# Altium schematic sheet Hélice31-V.2_2026-04-02.schdoc
size 235 x 182 mm
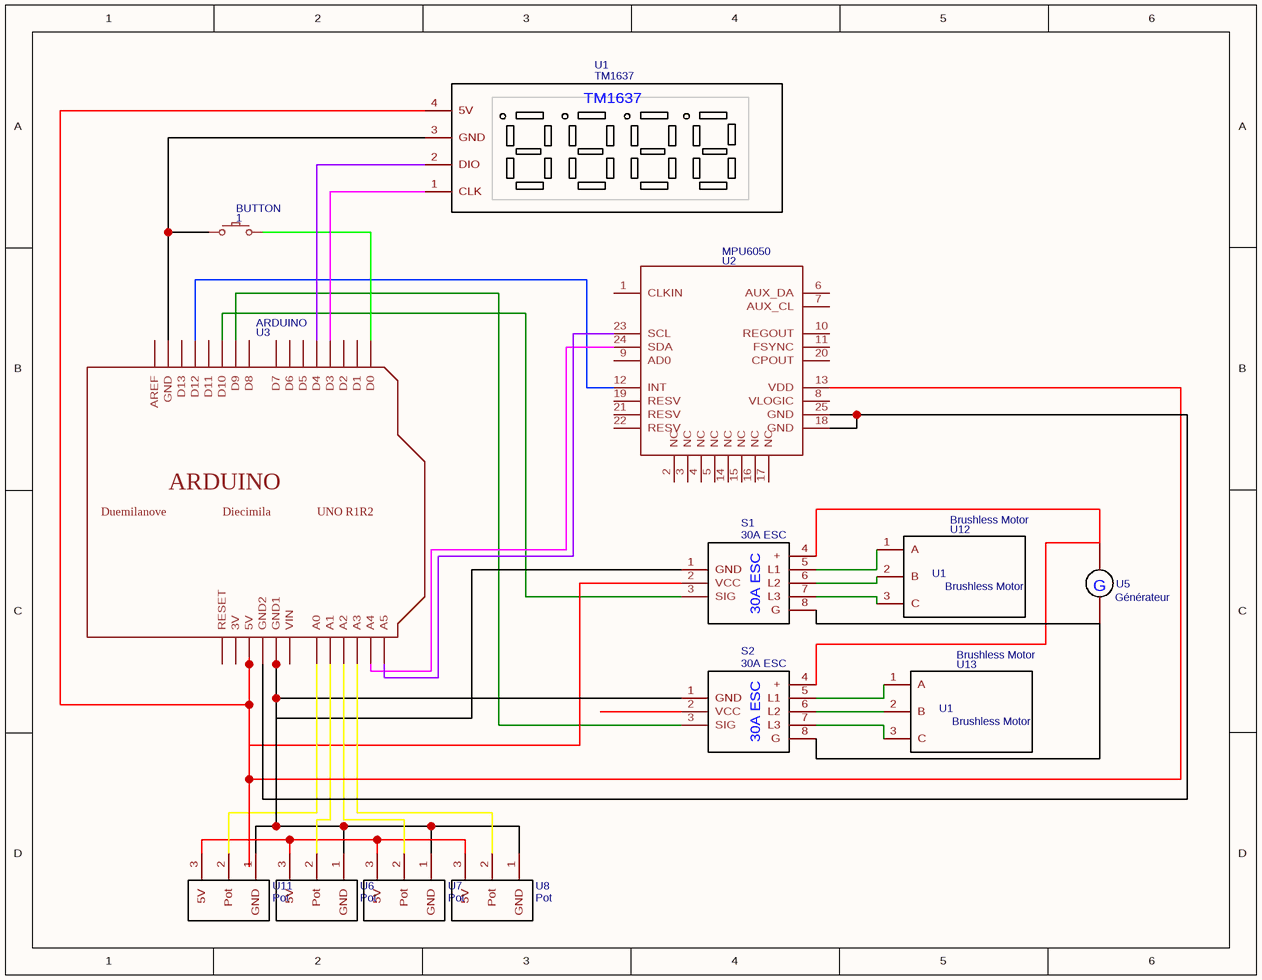
[diagram p0: Hélice31-V.2_2026-04-02.schdoc]

## Parts
1  BUTTON  [32TEETH---CONDUCTIVE-BUTTONS_CONDUCTIVE_BUTTON_DIRECTIONAL_THICK]
S1  30A ESC  [SG90 SERVO]
S2  30A ESC  [SG90 SERVO]
U1  TM1637  [4DIGITS-TM1637]
U2  MPU6050  [QFN50P400X400X95-25T265X275N]
U3  ARDUINO  [ARDUINO]
U5  Générateur
U6  Pot  [POTENTIOMETRE]
U7  Pot  [POTENTIOMETRE]
U8  Pot  [POTENTIOMETRE]
U11  Pot  [POTENTIOMETRE]
U12  Brushless Motor  [BRUSHLESS MOTOR]
U13  Brushless Motor  [BRUSHLESS MOTOR]

## Nets
Net1_P$ACTIVE: 1.P$ACTIVE U3.D0
Net1_P$GND: 1.P$GND U1.3(GND) U3.GND
NetS1_1: S1.1(GND) S2.1(GND) U3.GND1 U6.1(GND) U7.1(GND) U8.1(GND) U11.1(GND)
NetS1_2: S1.2(VCC) U1.4(5V) U2.13(VDD) U3.5V
NetS1_3: S1.3(SIG) U3.D10
NetS1_4: S1.4(+) S2.4(+)
NetS1_5: S1.5(L1) U12.1(A)
NetS1_6: S1.6(L2) U12.2(B)
NetS1_7: S1.7(L3) U12.3(C)
NetS1_8: S1.8(G) S2.8(G)
NetS2_3: S2.3(SIG) U3.D9
NetS2_5: S2.5(L1) U13.1(A)
NetS2_6: S2.6(L2) U13.2(B)
NetS2_7: S2.7(L3) U13.3(C)
NetU1_1: U1.1(CLK) U3.D3
NetU1_2: U1.2(DIO) U3.D4
NetU2_12: U2.12(INT) U3.D12
NetU2_18: U2.18(GND) U2.25(GND) U3.GND2
NetU2_23: U2.23(SCL) U3.A5
NetU2_24: U2.24(SDA) U3.A4
NetU3_A0: U3.A0 U11.2(Pot)
NetU3_A1: U3.A1 U6.2(Pot)
NetU3_A2: U3.A2 U7.2(Pot)
NetU3_A3: U3.A3 U8.2(Pot)
NetU6_3: U6.3(5V) U7.3(5V) U8.3(5V) U11.3(5V)

Not connected (* = marked no-connect by the designer): S2 2(VCC); U2 1(CLKIN) 2(NC) 3(NC) 4(NC) 5(NC) 6(AUX_DA) 7(AUX_CL) 8(VLOGIC) 9(AD0) 10(REGOUT) 11(FSYNC) 14(NC) 15(NC) 16(NC) 17(NC) 19(RESV) 20(CPOUT) 21(RESV) 22(RESV); U3 3V AREF D1 D2 D5 D6 D7 D8 D11 D13 RESET VIN; U5 1 2

## Notes on the sheet
- (in symbol ARDUINO) Duemilanove; Diecimila; UNO R1R2
- (in symbol Brushless Motor) U1
- (in symbol Générateur) G

## Library data of the parts
1 = BUTTON: Contributor: LorenzoVonMatterhorn; spicePre: ?; spiceSymbolName: BUTTON
S1 S2 = 30A ESC: Contributor: ilos; spicePre: S; spiceSymbolName: 30A ESC
U1 = TM1637: Contributor: sensorhost; spicePre: U; spiceSymbolName: TM1637
U3 = ARDUINO: Contributor: Adafruit; spicePre: U; spiceSymbolName: ARDUINO
U5 = Générateur: Contributor: oswin03; spicePre: U; spiceSymbolName: Générateur
U6-U8 U11 = Pot: Contributor: merlu.timothee; spicePre: U; spiceSymbolName: Pot
U12 U13 = Brushless Motor: Contributor: Droners; Manufacturer: N/A; Manufacturer Part: N/A; Supplier Part: N/A; spicePre: U; spiceSymbolName: Brushless Motor
U2 = MPU6050: spicePre: U; spiceSymbolName: MPU6050